# Altium schematic sheet transceiver.SchDoc
size A3
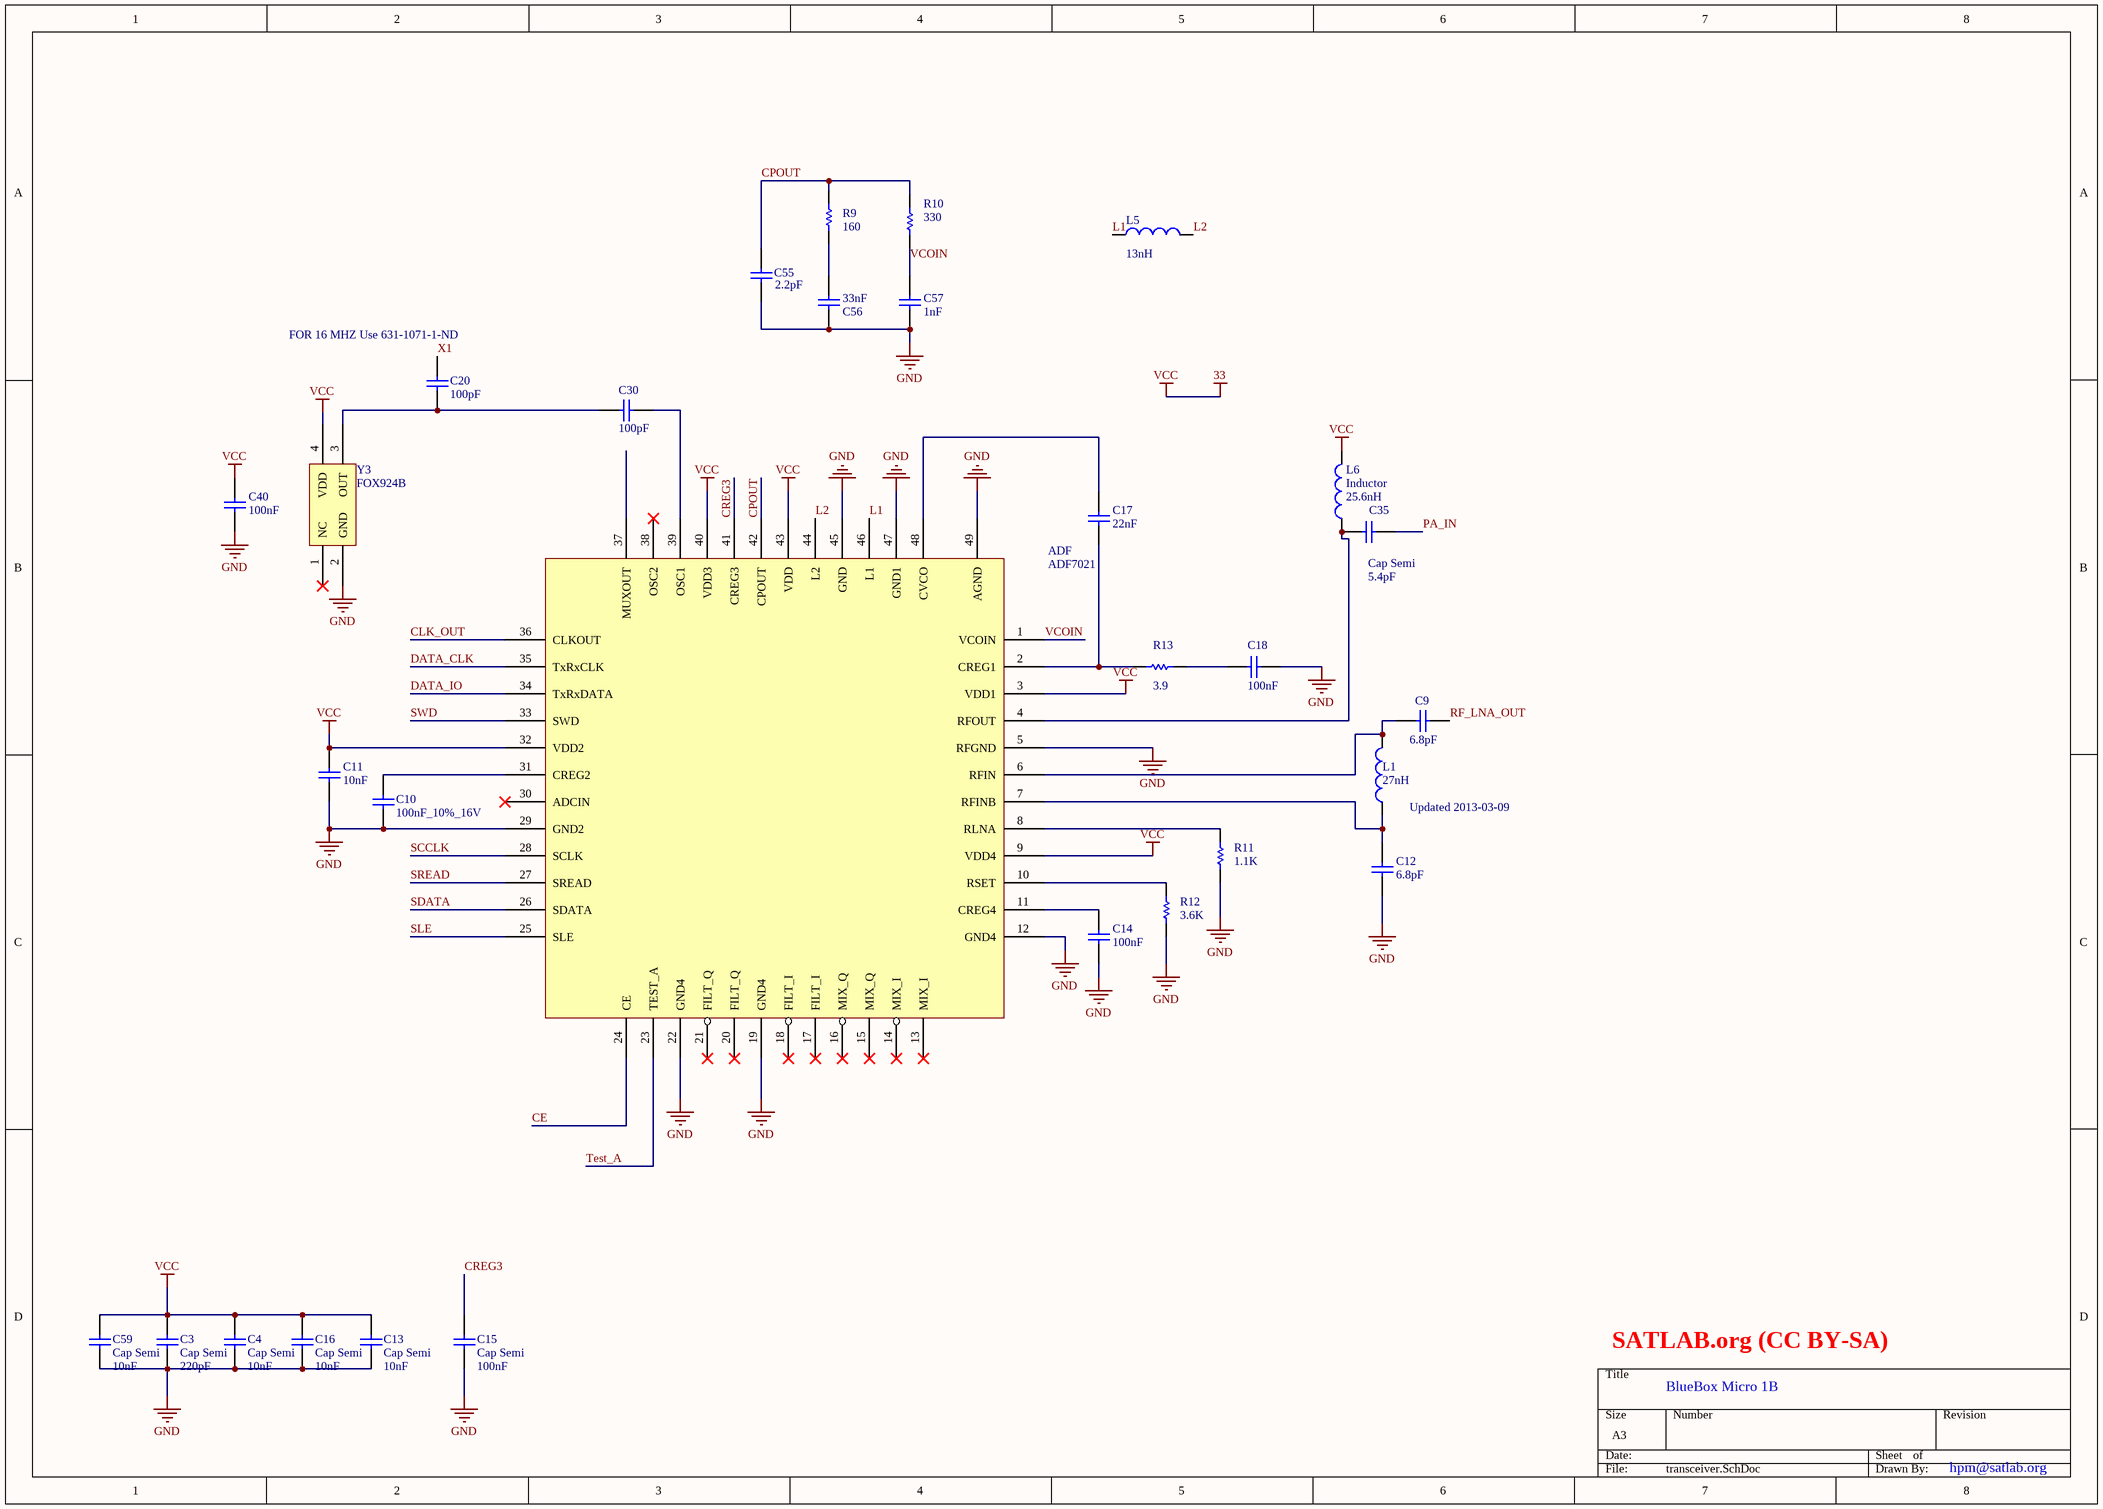
[diagram p0: transceiver.SchDoc]

## Parts
ADF  ADF7021  [QFN50P700X700X100-48M]
C3  Cap Semi  value 220pF  [C06]
C4  Cap Semi  value 10nF  [C06]
C9  value 6.8pF  [C06]  (hidden comment: Cap Semi)
C10  value 100nF_10%_16V  [C04]  (hidden comment: Capacitor)
C11  value 10nF  [C06]  (hidden comment: Cap Semi)
C12  value 6.8pF  [C06]  (hidden comment: Cap Semi)
C13  Cap Semi  value 10nF  [C06]
C14  value 100nF  [C06]  (hidden comment: Cap Semi)
C15  Cap Semi  value 100nF  [C06]
C16  Cap Semi  value 10nF  [C06]
C17  value 22nF  [C06]  (hidden comment: Cap Semi)
C18  value 100nF  [C06]  (hidden comment: Cap Semi)
C20  value 100pF  [C04]  (hidden comment: Capacitor)
C30  value 100pF  [C04]  (hidden comment: Capacitor)
C35  Cap Semi  value 5.4pF  [C06]
C40  value 100nF  [C06]  (hidden comment: Cap Semi)
C55  value 2.2pF  [C06]  (hidden comment: Cap Semi)
C56  value 33nF  [C06]  (hidden comment: Cap Semi)
C57  value 1nF  [C06]  (hidden comment: Cap Semi)
C59  Cap Semi  value 10nF  [C06]
L1  value 27nH  [C06]  (hidden comment: Inductor)
L5  value 13nH  [L06]  (hidden comment: Inductor)
L6  Inductor  value 25.6nH  [C06]
R9  value 160  [R06]  (hidden comment: Res Semi)
R10  value 330  [R06]  (hidden comment: Res Semi)
R11  value 1.1K  [R06]  (hidden comment: Res Semi)
R12  value 3.6K  [R06]  (hidden comment: Res Semi)
R13  value 3.9  [R06]  (hidden comment: Res Semi)
Y3  FOX924B  [Fox924]

## Nets
33: ADF.3(VDD1) ADF.9(VDD4) ADF.32(VDD2) ADF.40(VDD3) ADF.43(VDD) C3.2 C4.2 C11.2 C13.2 C16.2 C40.2 C59.2 L6.2 Y3.4(VDD)  [also labelled VCC]
GND: ADF.5(RFGND) ADF.12(GND4) ADF.19(GND4) ADF.22(GND4) ADF.29(GND2) ADF.45(GND) ADF.47(GND1) ADF.49(AGND) C3.1 C4.1 C10.1 C11.1 C12.1 C13.1 C14.1 C15.1 C16.1 C18.2 C40.1 C55.1 C56.1 C57.1 C59.1 R11.2 R12.1 Y3.2(GND)
CE: ADF.24(CE)
CLK_OUT: ADF.36(CLKOUT)
CPOUT: ADF.42(CPOUT) C55.2 R9.2 R10.2
CREG3: ADF.41(CREG3) C15.2
DATA_CLK: ADF.35(TxRxCLK)
DATA_IO: ADF.34(TxRxDATA)
L1: ADF.46(L1) L5.1
L2: ADF.44(L2) L5.2
PA_IN: C35.2
RF_LNA_OUT: C9.1
SCCLK: ADF.28(SCLK)
SDATA: ADF.26(SDATA)
SLE: ADF.25(SLE)
SREAD: ADF.27(SREAD)
SWD: ADF.33(SWD)
Test_A: ADF.23(TEST_A)
VCOIN: ADF.1(VCOIN) C57.2 R10.1
X1: C20.1
NetADF_2: ADF.2(CREG1) C17.1 R13.1
NetADF_4: ADF.4(RFOUT) C35.1 L6.1
NetADF_6: ADF.6(RFIN) C9.2 L1.2
NetADF_7: ADF.7(RFINB) C12.2 L1.1
NetADF_8: ADF.8(RLNA) R11.1
NetADF_10: ADF.10(RSET) R12.2
NetADF_11: ADF.11(CREG4) C14.2
NetADF_31: ADF.31(CREG2) C10.2
NetADF_39: ADF.39(OSC1) C30.1
NetADF_48: ADF.48(CVCO) C17.2
NetC18_1: C18.1 R13.2
NetC20_2: C20.2 C30.2 Y3.3(OUT)
NetC56_2: C56.2 R9.1

Not connected (* = marked no-connect by the designer): ADF 13(MIX_I)* 14(MIX_I)* 15(MIX_Q)* 16(MIX_Q)* 17(FILT_I)* 18(FILT_I)* 20(FILT_Q)* 21(FILT_Q)* 30(ADCIN)* 37(MUXOUT) 38(OSC2)*; Y3 1(NC)*

## Notes on the sheet
- Using http://www.calculatoredge.com/electronics/ch%20pi%20low%20pass.htm
- (near C20) FOR 16 MHZ Use 631-1071-1-ND
- Using http://bwrc.eecs.berkeley.edu/research/rf/projects/60ghz/matching/impmatch.html
- (near L1) Updated 2013-03-09
- SATLAB.org (CC BY-SA)
- BlueBox Micro 1B
- hpm@satlab.org

## Library data of the parts
ADF = ADF7021: ADF7021 transceiver; By: Nikolaj Bisgaard Pedersen; Datasheet: http://www.analog.com/static/imported-files/data_sheets/ADF7021.pdf; Homepage: http://www.analog.com/en/rfif-components/short-range-transceivers/adf7021/products/product.html; Supplier 1: Digi-Key; Supplier Part Number 1: ADF7021BCPZ-ND
C3 C4 C9 C11-C18 C35 C40 C55-C57 C59 = Cap Semi: Capacitor (Semiconductor SIM Model); Published: 8-Jun-2000; LatestRevisionDate: 17-Jul-2002; LatestRevisionNote: Re-released for DXP Platform.; PackageReference: C1206; Publisher: Altium Limited
C10 C20 C30 = Capacitor: Capacitor, standard
L5 = Inductor: Code_IEC: 1005; Published: 8-Jun-2000; LatestRevisionDate: 29-May-2009; LatestRevisionNote: IPC-7351 Footprint Added.; PackageReference: 0402-A; Publisher: Altium Limited; PackageDescription: Chip Inductor; Code_JEITA: 0402
R9-R13 = Res Semi: Semiconductor Resistor; Published: 8-Jun-2000; LatestRevisionDate: 17-Jul-2002; LatestRevisionNote: Re-released for DXP Platform.; PackageReference: AXIAL-0.5; Publisher: Altium Limited
Y3 = FOX924B: FOX924B TCXO 19.44 MHz; By: Nikolaj B. Pedersen; Username: Markem; Datasheet: http://www.foxonline.com/pdfs/fox924.pdf; Digikey: 631-1072-1-ND; Supplier 1: Digi-Key; Supplier 2: Farnell; Supplier Part Number 1: 631-1072-1-ND; Supplier Part Number 2: 2063960
L1 L6 = Inductor: Published: 07-04-2008; LatestRevisionNote: Aalborg University; PackageReference: 0402-A; Publisher: <HP>; Digikey: 495-2017-1-ND